# EAGLE design aparture_v1 (EAGLE 6.3)
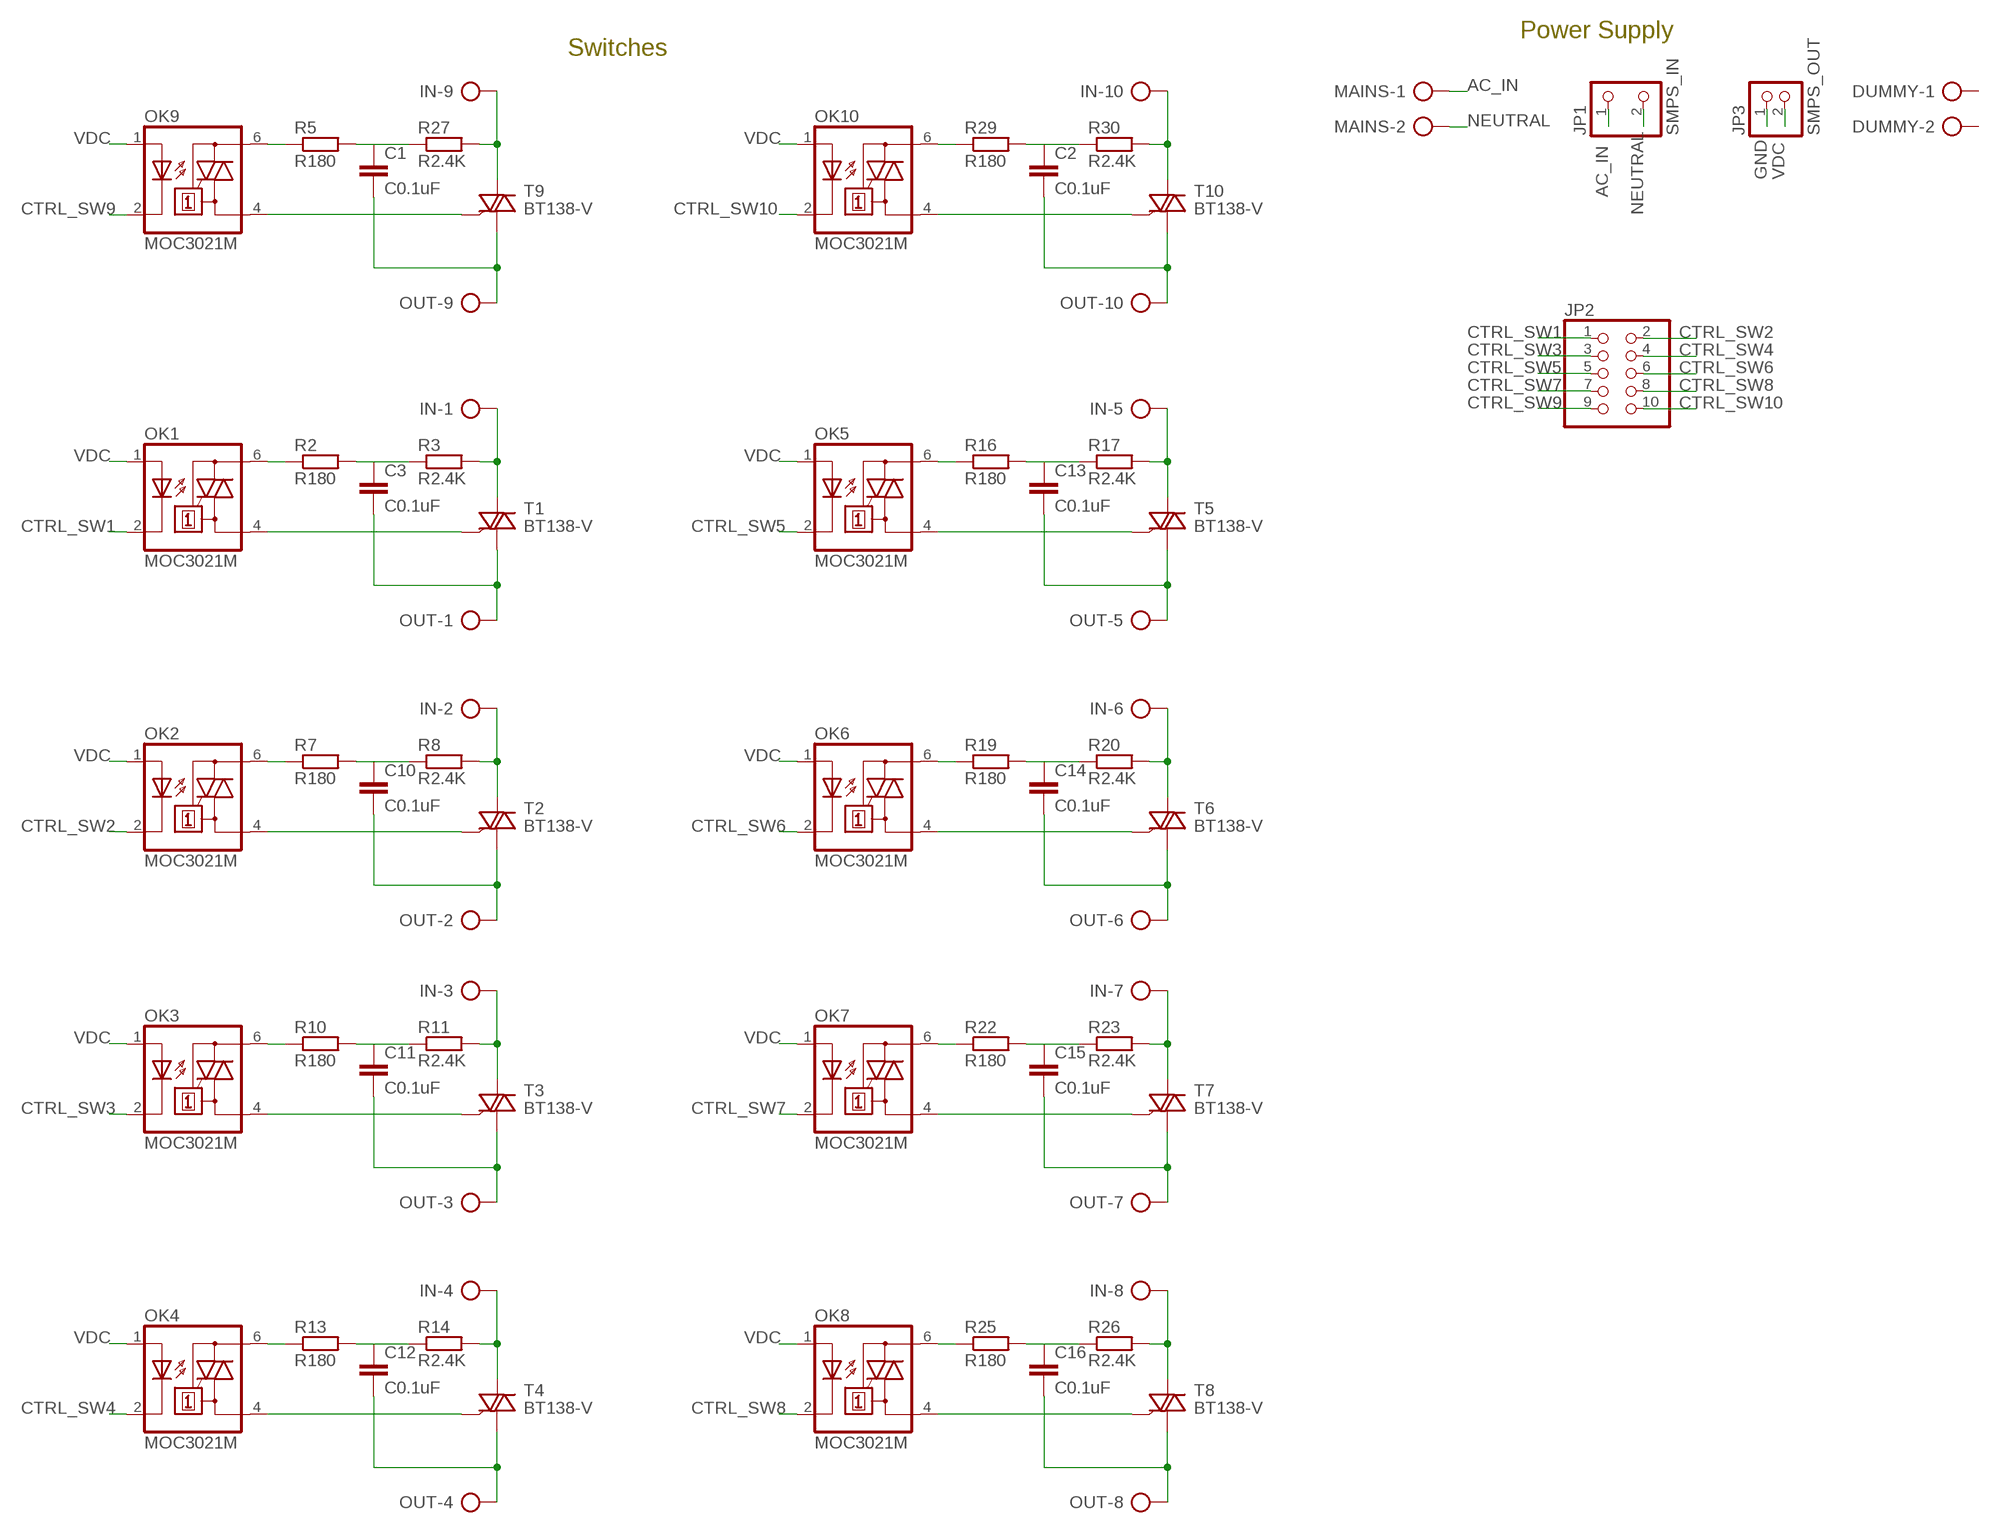
[diagram p0: schematic, sheet 1]

## Parts
C1  C0.1uF  C-EUC0805  [C0805]
C2  C0.1uF  C-EUC0805  [C0805]
C3  C0.1uF  C-EUC0805  [C0805]
C10  C0.1uF  C-EUC0805  [C0805]
C11  C0.1uF  C-EUC0805  [C0805]
C12  C0.1uF  C-EUC0805  [C0805]
C13  C0.1uF  C-EUC0805  [C0805]
C14  C0.1uF  C-EUC0805  [C0805]
C15  C0.1uF  C-EUC0805  [C0805]
C16  C0.1uF  C-EUC0805  [C0805]
DUMMY  AK300/2  [AK300/2]
IN  AK300/10  [AK300/10]
JP1  SMPS_IN  [SMPS_IN]
JP2  PINHD-2X5  [2X05]
JP3  SMPS_OUT  PINHD-1X2  [1X02]
MAINS  AK300/2  [AK300/2]
OK1  MOC3021M  [DIL06]
OK2  MOC3021M  [DIL06]
OK3  MOC3021M  [DIL06]
OK4  MOC3021M  [DIL06]
OK5  MOC3021M  [DIL06]
OK6  MOC3021M  [DIL06]
OK7  MOC3021M  [DIL06]
OK8  MOC3021M  [DIL06]
OK9  MOC3021M  [DIL06]
OK10  MOC3021M  [DIL06]
OUT  AK300/10  [AK300/10]
R2  R180  R-EU_M0805  [M0805]
R3  R2.4K  R-EU_M0805  [M0805]
R5  R180  R-EU_M0805  [M0805]
R7  R180  R-EU_M0805  [M0805]
R8  R2.4K  R-EU_M0805  [M0805]
R10  R180  R-EU_M0805  [M0805]
R11  R2.4K  R-EU_M0805  [M0805]
R13  R180  R-EU_M0805  [M0805]
R14  R2.4K  R-EU_M0805  [M0805]
R16  R180  R-EU_M0805  [M0805]
R17  R2.4K  R-EU_M0805  [M0805]
R19  R180  R-EU_M0805  [M0805]
R20  R2.4K  R-EU_M0805  [M0805]
R22  R180  R-EU_M0805  [M0805]
R23  R2.4K  R-EU_M0805  [M0805]
R25  R180  R-EU_M0805  [M0805]
R26  R2.4K  R-EU_M0805  [M0805]
R27  R2.4K  R-EU_M0805  [M0805]
R29  R180  R-EU_M0805  [M0805]
R30  R2.4K  R-EU_M0805  [M0805]
T1  BT138-V  [TO220BV]
T2  BT138-V  [TO220BV]
T3  BT138-V  [TO220BV]
T4  BT138-V  [TO220BV]
T5  BT138-V  [TO220BV]
T6  BT138-V  [TO220BV]
T7  BT138-V  [TO220BV]
T8  BT138-V  [TO220BV]
T9  BT138-V  [TO220BV]
T10  BT138-V  [TO220BV]

## Nets
AC_IN: JP1.1 MAINS.1
CTRL_SW1: JP2.1 OK1.2(C)
CTRL_SW2: JP2.2 OK2.2(C)
CTRL_SW3: JP2.3 OK3.2(C)
CTRL_SW4: JP2.4 OK4.2(C)
CTRL_SW5: JP2.5 OK5.2(C)
CTRL_SW6: JP2.6 OK6.2(C)
CTRL_SW7: JP2.7 OK7.2(C)
CTRL_SW8: JP2.8 OK8.2(C)
CTRL_SW9: JP2.9 OK9.2(C)
CTRL_SW10: JP2.10 OK10.2(C)
GND: JP3.1
N$3: OK1.6(A2) R2.1
N$4: C3.1 R2.2 R3.1
N$5: OK1.4(A1) T1.G
N$6: C3.2 OUT.1 T1.T1(A1)
N$9: IN.1 R3.2 T1.T2(A2)
N$12: OK2.6(A2) R7.1
N$13: C10.1 R7.2 R8.1
N$14: OK2.4(A1) T2.G
N$15: C10.2 OUT.2 T2.T1(A1)
N$18: OK3.6(A2) R10.1
N$19: C11.1 R10.2 R11.1
N$20: OK3.4(A1) T3.G
N$21: C11.2 OUT.3 T3.T1(A1)
N$24: OK4.6(A2) R13.1
N$25: C12.1 R13.2 R14.1
N$26: OK4.4(A1) T4.G
N$27: C12.2 OUT.4 T4.T1(A1)
N$30: OK5.6(A2) R16.1
N$31: C13.1 R16.2 R17.1
N$32: OK5.4(A1) T5.G
N$33: C13.2 OUT.5 T5.T1(A1)
N$36: OK6.6(A2) R19.1
N$37: C14.1 R19.2 R20.1
N$38: OK6.4(A1) T6.G
N$39: C14.2 OUT.6 T6.T1(A1)
N$42: OK7.6(A2) R22.1
N$43: C15.1 R22.2 R23.1
N$44: OK7.4(A1) T7.G
N$45: C15.2 OUT.7 T7.T1(A1)
N$48: OK8.6(A2) R25.1
N$49: C16.1 R25.2 R26.1
N$50: OK8.4(A1) T8.G
N$51: C16.2 OUT.8 T8.T1(A1)
N$52: IN.2 R8.2 T2.T2(A2)
N$53: IN.3 R11.2 T3.T2(A2)
N$54: IN.4 R14.2 T4.T2(A2)
N$55: IN.8 R26.2 T8.T2(A2)
N$56: IN.7 R23.2 T7.T2(A2)
N$57: IN.6 R20.2 T6.T2(A2)
N$58: IN.5 R17.2 T5.T2(A2)
N$59: OK9.6(A2) R5.1
N$60: C1.1 R5.2 R27.1
N$61: OK9.4(A1) T9.G
N$62: C1.2 OUT.9 T9.T1(A1)
N$65: OK10.6(A2) R29.1
N$66: C2.1 R29.2 R30.1
N$67: OK10.4(A1) T10.G
N$68: C2.2 OUT.10 T10.T1(A1)
N$69: IN.9 R27.2 T9.T2(A2)
N$70: IN.10 R30.2 T10.T2(A2)
NEUTRAL: JP1.2 MAINS.2
VDC: JP3.2 OK1.1(A) OK2.1(A) OK3.1(A) OK4.1(A) OK5.1(A) OK6.1(A) OK7.1(A) OK8.1(A) OK9.1(A) OK10.1(A)
Unconnected: DUMMY.1 DUMMY.2

## Notes on the sheet
- Power Supply
- Switches

## Library data of the parts
C1-C3 C10-C16 = resistor:C-EU: CAPACITOR, European symbol
DUMMY MAINS = con-ptr500:AK300/2: CONNECTOR; OC_FARNELL: unknown; OC_NEWARK: unknown
IN OUT = con-ptr500:AK300/10: CONNECTOR; OC_FARNELL: unknown; OC_NEWARK: unknown
JP1 = tigorcustom:SMPS_IN: PIN HEADER
JP2 = pinhead:PINHD-2X5: PIN HEADER
JP3 = pinhead:PINHD-1X2: PIN HEADER
OK1-OK10 = optocoupler:MOC30*M: RANDOM-PHASE OPTOISOLATORS TRIAC DRIVER OUTPUT Source: http://www.fairchildsemi.com MOC3020-M.pdf; MF: FAIRCHILD SEMICONDUCTOR; MPN: MOC3021-M; OC_FARNELL: 1021365; OC_NEWARK: 95B7895
R2 R3 R5 R7 R8 R10 R11 R13 R14 R16 R17 R19 R20 R22 R23 R25-R27 R29 R30 = resistor:R-EU_: RESISTOR, European symbol
T1-T10 = triac:BT138: TRIAC Source: http://www.semiconductors.philips.com BT138_SERIES_2.pdf

## Board
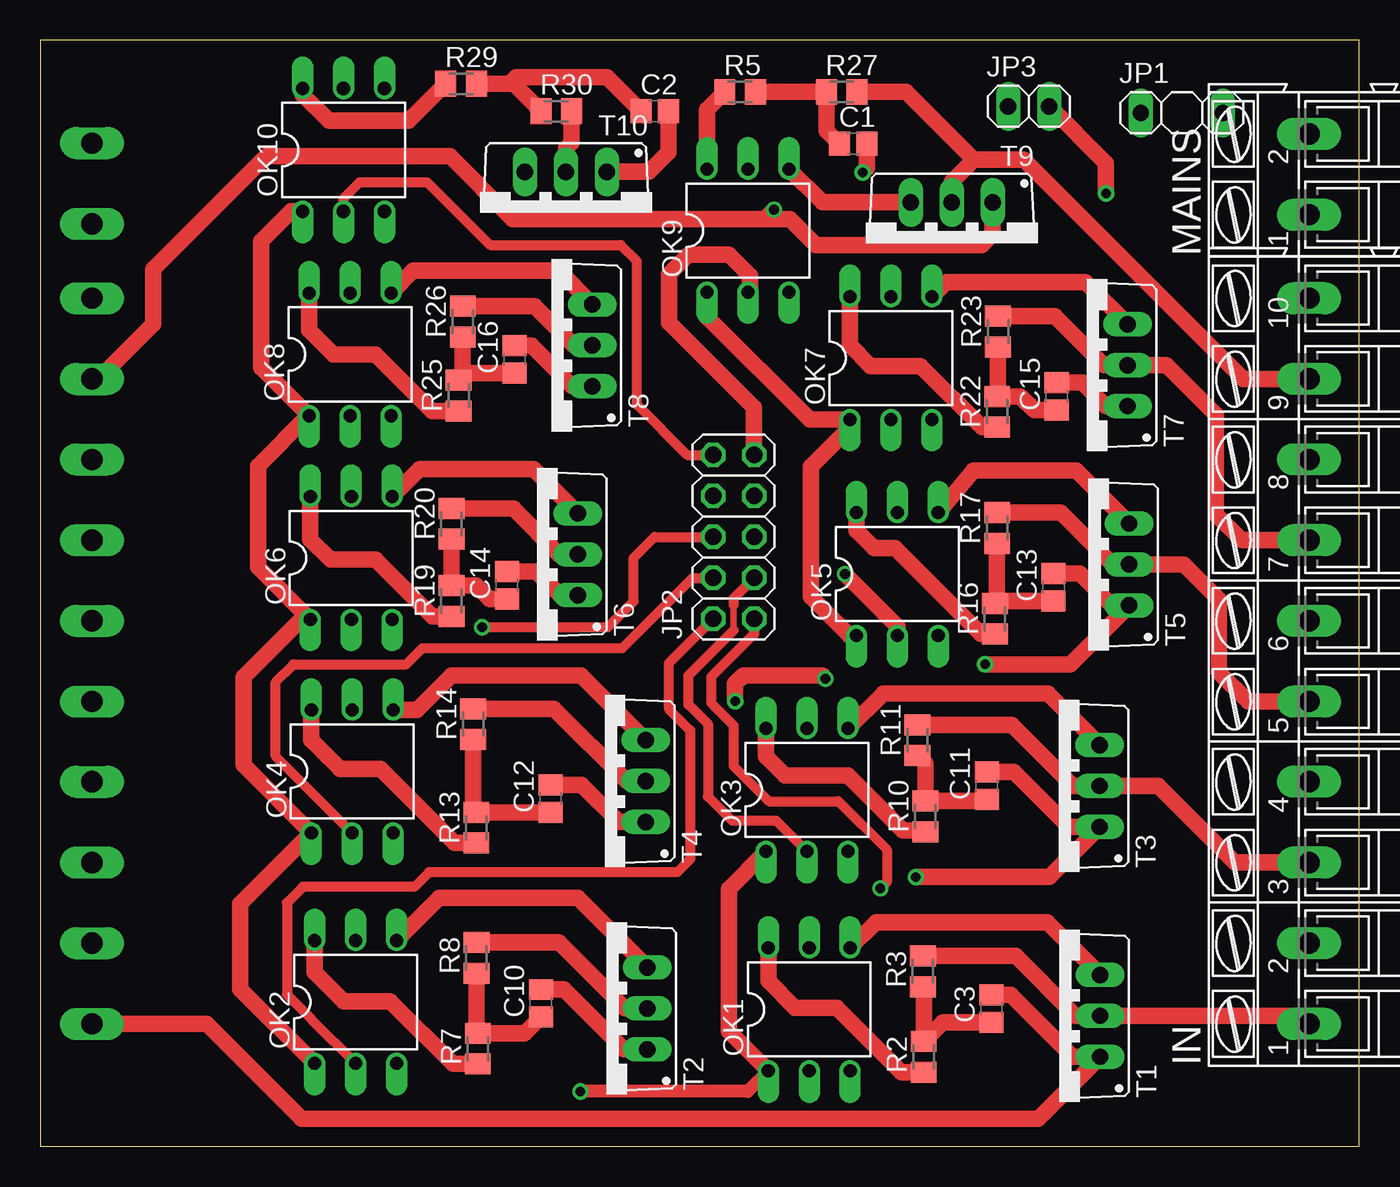
[diagram p1: board, top side]
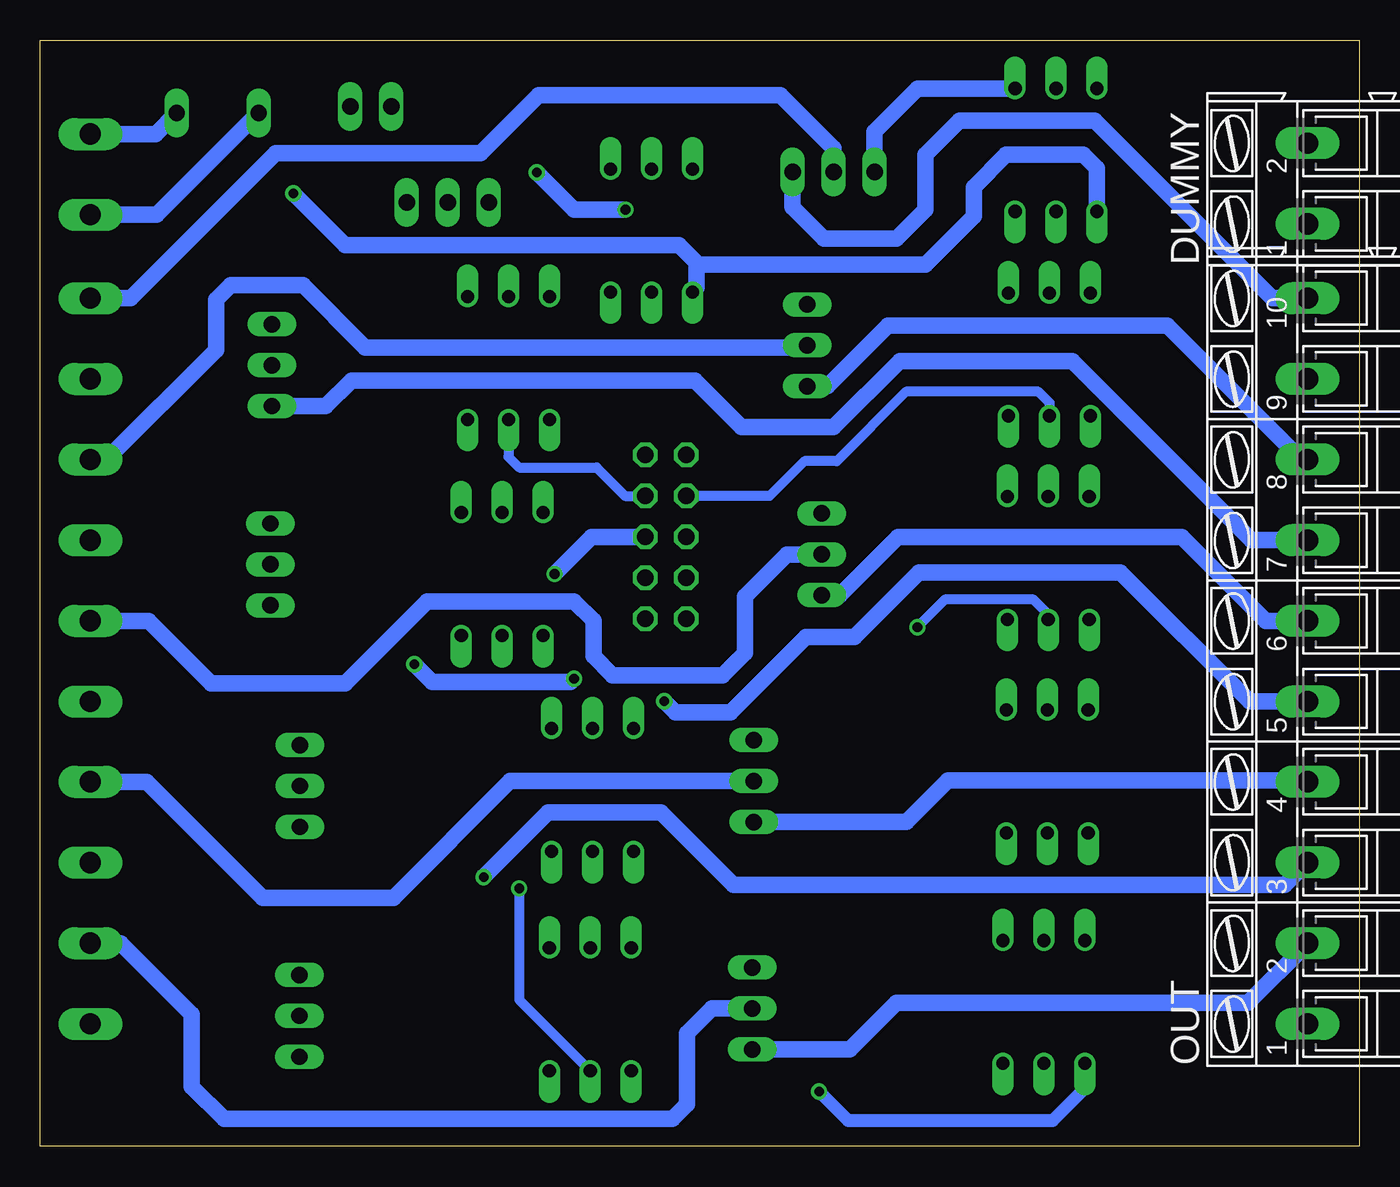
[diagram p2: board, bottom side, seen from below]

Size 81.8 x 68.6 mm. Coordinates in mm from the lower left corner, seen from the top.
Outline: 0,0 81.8,0 81.8,68.6 0,68.6 0,0
Copper layers (1*16): Top 0.035mm / dielectric 1.5mm / Bottom 0.035mm
Design rules "default": minimum track width 10mil, minimum drill 24mil, track to track 8mil, track to pad 8mil, pad to pad 8mil, via to via 8mil, smd to smd 8mil, copper to edge 40mil, drill to drill 8mil, minimum pad ring 10mil, minimum via ring 8mil, stop-mask expansion 4mil, vias tented up to drill 0mil, thermal gap 10mil

### Footprints (pad centres in the part's own frame; a part is rotated, then mirrored left to right if it is on the bottom)
C0805 = smd 1.3 x 1.5: 1 -0.85,0; 2 0.85,0
AK300/2 = drill 1.321 long: 1 -2.515,0; 2 2.489,0
AK300/10 = drill 1.321 long: 1 -22.504,0; 2 -17.501,0; 3 -12.497,0; 4 -7.493,0; 5 -2.515,0; 6 2.489,0; 7 7.493,0; 8 12.497,0; 9 17.501,0; 10 22.504,0
SMPS_IN = drill 1.016 long: 1 -2.54,0; 2 2.54,0
2X05 = drill 1.016 octagon: 1 -5.08,-1.27; 2 -5.08,1.27; 3 -2.54,-1.27; 4 -2.54,1.27; 5 0,-1.27; 6 0,1.27; 7 2.54,-1.27; 8 2.54,1.27; 9 5.08,-1.27; 10 5.08,1.27
1X02 = drill 1.016 long: 1 -1.27,0; 2 1.27,0
DIL06 = drill 0.813 offset: 1 -2.54,-3.81; 2 0,-3.81; 3 2.54,-3.81; 4 2.54,3.81; 5 0,3.81; 6 -2.54,3.81
M0805 = smd 1.3 x 1.6: 1 -0.95,0; 2 0.95,0
TO220BV = drill 1.016 long: G 2.54,-2.54; T1 -2.54,-2.54; T2 0,-2.54

### Placement (x,y rotation side)
C1  50.41,62.19 0 top
C2  38.1,64.2 0 top
C3  58.99,8.55 90 top
C10  31.05,8.87 90 top
C11  58.7,22.37 90 top
C12  31.65,21.57 90 top
C13  62.84,34.67 90 top
C14  28.94,34.79 90 top
C15  63.04,46.51 90 top
C16  29.42,48.8 90 top
DUMMY  3.2,59.73 90 bottom
IN  78.7,30.1 90 top
JP1  70.8,64.1 0 top
JP2  43,37.8 90 top
JP3  61.3,64.5 0 top
MAINS  78.7,60.3 90 top
OK1  47.69,8.49 0 top
OK2  19.55,8.95 0 top
OK3  47.55,22.1 0 top
OK4  19.35,23.25 0 top
OK5  53.15,35.49 0 top
OK6  19.29,36.49 0 top
OK7  52.76,48.89 0 top
OK8  19.22,49.12 0 top
OK9  43.9,56.8 0 top
OK10  18.8,61.8 0 top
OUT  3.2,30.1 90 bottom
R2  54.79,5.55 90 top
R3  54.74,10.85 90 top
R5  43.4,65.4 0 top
R7  27.14,6.06 90 top
R8  27.05,11.69 90 top
R10  54.89,20.46 90 top
R11  54.4,25.19 90 top
R13  27.04,19.76 90 top
R14  26.85,26.19 90 top
R16  59.2,32.72 90 top
R17  59.34,38.35 90 top
R19  25.5,33.82 90 top
R20  25.5,38.61 90 top
R22  59.35,45.56 90 top
R23  59.4,50.53 90 top
R25  25.95,46.56 90 top
R26  26.2,51.15 90 top
R27  49.7,65.4 0 top
R29  26.1,65.9 0 top
R30  32,64.2 0 top
T1  63.2,8.09 90 top
T2  35.11,8.55 90 top
T3  63.16,22.35 90 top
T4  35.01,22.65 90 top
T5  65,36.09 90 top
T6  30.8,36.72 90 top
T7  64.9,48.45 90 top
T8  31.7,49.68 90 top
T9  56.53,56.01 180 top
T10  32.6,57.9 180 top

### Tracks (layer width: path | path; a pad name or v marks a point on that pad's centre or on a via)
AC_IN
  Bottom 1.016: 77.7,57.78 MAINS.1 74.58,57.78 JP1.1
CTRL_SW1  (via drill 0.6)
  Top 0.61: JP2.1 44.27,31.77 41.6,29.1 41.6,27.5 43,26.1 43,23.6 45.2,21.4 49.5,21.4 52.5,18.4 52.5,16.4 v52.1,16
  Bottom 0.61: v52.1,16 52.1,9.09 OK1.2
CTRL_SW2
  Top 0.61: JP2.2 39,29.99 39,27.1 40.3,25.8 40.3,17.8 39.5,17 24.1,17 23.2,16.1 16.3,16.1 15.3,15.1 15.3,9.4 16.8,7.9 16.8,7.89 OK2.2
CTRL_SW3
  Top 0.406: 43,33.6 43,32
  Top 0.61: JP2.3 43,33.99 43,33.6 | 43,32 40.2,29.2 40.2,27.4 41.4,26.2 41.4,21.7 42.9,20.2 45.64,20.2 OK3.2
CTRL_SW4
  Top 0.61: OK4.2 14.6,24.19 14.6,28.8 15.7,29.9 22.7,29.9 23.7,30.9 36.1,30.9 40.46,35.26 JP2.4
CTRL_SW5  (via drill 0.6)
  Top 1.016: v49.9,35.5 53.15,32.25 OK5.2
  Bottom 1.016: v49.9,35.5 47.6,37.8 JP2.5
CTRL_SW6  (via drill 0.6)
  Top 0.61: JP2.6 38.1,37.8 36.8,36.5 36.8,33.8 35.2,32.2 v27.4,32.2
  Bottom 0.61: v27.4,32.2 25.7,33.9 20.2,33.9 19.29,32.99 OK6.2
CTRL_SW7
  Bottom 0.61: OK7.2 52.76,42.76 52.1,42.1 47.3,42.1 45.54,40.34 JP2.7
CTRL_SW8
  Bottom 0.61: OK8.2 19.2,45.33 19.2,46.1 19.9,46.8 28.1,46.8 32.4,42.5 34.4,42.5 36.56,40.34 JP2.8
CTRL_SW9
  Top 1.016: OK9.2 44,53.09 44,54 42.7,55.3 40.2,55.3 39,54.1 39,51.1 44.27,45.83 JP2.9
CTRL_SW10
  Top 0.61: JP2.10 40.12,42.88 37,46 37,54.9 36,55.9 27.9,55.9 24,59.8 19.8,59.8 18.8,58.8 OK10.2
N$3
  Top 1.016: R2.1 53.4,4.6 49.4,8.6 46.8,8.6 45.15,10.25 OK1.6
N$4
  Top 1.016: C3.1 55.99,7.7 R2.2 54.79,9.85 R3.1
N$5
  Top 1.016: T1.G 62.47,13.9 51.83,13.9 OK1.4
N$6
  Top 1.016: C3.2 60.2,9.4 64.05,5.55 T1.T1 61.89,1.7 16.2,1.7 10.3,7.6 OUT.1
N$9
  Top 1.016: R3.2 60.5,11.8 64.21,8.09 T1.T2 78.21,8.09 IN.1
N$12
  Top 1.016: R7.1 25.59,5.11 21.7,9 18.8,9 17.01,10.79 OK2.6
N$13
  Top 1.016: R8.1 27.05,7.1 R7.2 30.04,7.01 C10.1
N$14
  Top 1.016: T2.G 33.34,15.4 24.73,15.4 OK2.4
N$15
  Top 1.016: T2.T1 36.19,6.01 32.48,9.72 C10.2
  Bottom 1.016: T2.T1 31.59,6.01 28.7,8.9 6.9,8.9 OUT.2
N$18
  Top 1.016: OK3.6 45.01,24.19 46.2,23 50.1,23 53.5,19.6 54.8,19.6 R10.1
N$19
  Top 1.016: C11.1 58.59,21.41 R10.2 54.89,23.75 R11.1
N$20
  Top 1.016: T3.G 62.49,28.1 52.28,28.1 OK3.4
N$21  (via drill 0.6)
  Top 1.016: C11.2 60.38,23.22 63.79,19.81 T3.T1 62.59,16.7 v54.3,16.7
  Bottom 1.016: v54.3,16.7 50.3,20.7 43.3,20.7 38.8,16.2 4.6,16.2 OUT.3
N$24
  Top 1.016: R13.1 25.69,18.81 21.1,23.4 18.6,23.4 16.81,25.19 OK4.6
N$25
  Top 1.016: R14.1 26.85,20.9 R13.2 30.34,20.71 C12.1
N$26
  Top 1.016: T4.G 33.54,29.2 25.5,29.2 23.36,27.06 OK4.4
N$27
  Top 1.016: 36.49,20.11 T4.T1 35.89,20.11 33.58,22.42 C12.2
  Bottom 1.016: T4.T1 28.09,20.11 25.5,22.7 3.2,22.7 OUT.4
N$30
  Top 1.016: OK5.6 50.61,38.19 51.7,37.1 53.01,37.1 58.34,31.77 R16.1
N$31
  Top 1.016: C13.1 59.35,33.82 | 59.35,33.82 R16.2 | 59.35,33.82 59.34,33.83 R17.1
N$32
  Top 1.016: T5.G 64.27,41.9 57.86,41.9 OK5.4
N$33  (via drill 0.6)
  Top 1.016: C13.2 64.48,35.52 66.45,33.55 T5.T1 63.89,29.9 v58.6,29.9 | v43.1,27.6 43.1,28.7 43.6,29.2 48.5,29.2 v48.7,29
  Bottom 1.016: v48.7,29 48.9,28.8 57.5,28.8 v58.6,29.9 | v43.1,27.6 42.4,26.9 39,26.9 34.3,31.6 31.3,31.6 27.3,35.6 14.8,35.6 6.79,27.59 OUT.5
N$36
  Top 1.016: R19.1 24.33,32.87 20.8,36.4 18,36.4 16.75,37.65 OK6.6
N$37
  Top 1.016: 25.3,37.46 R20.1 R19.2 27.03,34.77 27.86,33.94 C14.1
N$38
  Top 1.016: T6.G 30.6,42 23.53,42 OK6.4
N$39
  Top 1.016: T6.T1 32.22,34.18 30.76,35.64 C14.2
  Bottom 1.016: T6.T1 32.22,34.18 28.6,37.8 11,37.8 5.79,32.59 OUT.6
N$42
  Top 1.016: R22.1 58.39,44.61 54.6,48.4 51.5,48.4 50.2,49.7 50.22,49.72 OK7.6
N$43
  Top 1.016: 59.15,49.33 R23.1 59.4,46.56 R22.2 60.79,46.51 61.64,45.66 C15.1
N$44
  Top 1.016: T7.G 64.83,53.6 56.2,53.6 OK7.4
N$45
  Top 1.016: T7.T1 66.09,45.91 64.64,47.36 C15.2
  Bottom 1.016: T7.T1 64.09,45.91 62.5,47.5 41.2,47.5 38.3,44.6 32.6,44.6 28.5,48.7 17.8,48.7 6.69,37.59 OUT.7
N$48
  Top 1.016: R25.1 24.29,45.61 20.8,49.1 18.2,49.1 16.68,50.62 OK8.6
N$49
  Top 1.016: R26.1 26.2,47.76 R25.2 26.39,47.95 C16.1
N$50
  Top 1.016: OK8.4 23.13,54.3 32.16,54.3 T8.G
N$51
  Top 1.016: C16.2 30.47,49.65 32.98,47.14 T8.T1
  Bottom 1.016: OUT.8 3.6,42.6 11.9,50.9 29.22,50.9 32.98,47.14 T8.T1
N$52
  Top 1.016: T2.T2 36.25,8.55 32.16,12.64 R8.2
  Bottom 1.016: IN.2 76.8,12.6 72.4,8.2 72.4,3.7 70.4,1.7 42.6,1.7 41.7,2.6 41.7,7 40.15,8.55 T2.T2
N$53
  Top 1.016: IN.3 74.1,17.6 69.35,22.35 T3.T2 64.05,22.35 60.26,26.14 R11.2
N$54
  Top 1.016: T4.T2 36.35,22.65 31.86,27.14 R14.2
  Bottom 1.016: IN.4 75.21,22.61 68,15.4 59.9,15.4 52.65,22.65 T4.T2
N$55
  Top 1.016: T8.T2 33.07,49.68 30.65,52.1 R26.2
  Bottom 1.016: IN.8 77.7,42.6 70.9,49.4 70.9,52.5 70,53.4 65.5,53.4 61.65,49.55 34.37,49.55 T8.T2
N$56
  Top 1.016: IN.7 74.51,37.59 72.9,39.2 72.9,45.4 69.85,48.45 T7.T2 65.95,48.45 62.92,51.48 R23.2
N$57
  Top 1.016: T6.T2 32.18,36.72 29.34,39.56 R20.2
  Bottom 1.016: IN.6 75.09,32.59 71.2,28.7 62.9,28.7 57.8,33.8 48.7,33.8 47.5,32.6 47.5,30.4 46.3,29.2 39.5,29.2 38.1,30.6 38.1,34.1 35.48,36.72 T6.T2
N$58
  Top 1.016: IN.5 74.92,27.59 73.1,29.4 73.1,33.9 70.91,36.09 T5.T2 66.51,36.09 63.3,39.3 R17.2
N$59
  Top 1.016: R5.1 41.36,64.31 OK9.6
N$60
  Top 1.016: R5.2 R27.1 48.75,63 C1.1
N$61
  Top 1.016: T9.G 48.5,58.55 OK9.4
N$62  (via drill 0.6)
  Top 1.016: 59.04,57.44 59.05,57.89 | 59.05,57.89 T9.T1 | OUT.9 3.6,47.6 7,51 7,54.4 14,61.4 25.4,61.4 29.3,57.5 44.4,57.5 44.9,57.5 | 44.9,57.5 46.5,57.5 48.1,55.9 58.4,55.9 59.05,56.55 59.05,57.89 | C1.2 51.26,60.66 v51,60.4 | v45.5,58.1 44.9,57.5
  Bottom 1.016: v51,60.4 48.7,58.1 v45.5,58.1
N$65
  Top 1.016: OK10.6 16.26,65.24 17.9,63.6 22.85,63.6 R29.1
N$66
  Top 1.016: R30.1 29.35,65.9 29.1,65.9 | 29.1,65.9 R29.2 | C2.1 35.15,66.3 29.5,66.3 29.1,65.9
N$67
  Bottom 1.016: T10.G 30.06,62.94 27.39,65.61 OK10.4
N$68
  Top 1.016: 35.45,60.75 T10.T1 37.74,60.44 38.95,61.65 C2.2
  Bottom 1.016: T10.T1 35.14,58.24 33.2,56.3 28.7,56.3 26.9,58.1 26.9,61.5 24.8,63.6 16.4,63.6 5.4,52.6 OUT.10
N$69
  Top 1.016: IN.9 74.6,47.6 61,61.2 57.9,61.2 | 57.9,61.2 56.53,59.83 T9.T2 | R27.2 53.7,65.4 57.9,61.2
N$70
  Top 1.016: T10.T2 32.6,61.9 32.95,62.25 R30.2
  Bottom 1.016: T10.T2 32.6,61.9 35.9,65.2 50.9,65.2 54.5,61.6 67.2,61.6 76.2,52.6 IN.10 77.7,52.6
NEUTRAL
  Bottom 1.016: 77.7,62.79 MAINS.2 74.65,62.79 JP1.2
VDC  (via drill 0.6)
  Top 0.813: OK1.1 43.87,3.4 v33.5,3.4
  Top 1.016: OK2.1 12.4,9.75 12.4,15.03 OK4.1 12.6,23.65 12.6,29.1 16.18,32.68 OK6.1 13.5,35.93 13.5,42.2 16.61,45.31 OK8.1 13.7,48.29 13.7,56.13 15.56,57.99 OK10.1 | OK3.1 42.7,15.98 42.7,7.13 OK1.1 | OK5.1 50.18,31.68 47.8,34.06 47.8,42.16 50.22,44.58 OK7.1 47.72,45.08 41.36,51.44 OK9.1 | v66.1,59.1 66.1,60.97 JP3.2
  Bottom 0.813: v33.5,3.4 31.7,1.6 19,1.6 17.01,3.59 OK2.1
  Bottom 1.016: OK10.1 16.26,60.66 17.1,61.5 21.9,61.5 23.9,59.5 23.9,57.7 26.9,54.7 41,54.7 | 41,54.7 41.07,54.7 | 41.1,54.8 42.2,55.9 62.9,55.9 v66.1,59.1 | 41.1,54.8 41,54.7 | OK9.1 41.1,53.25 41.1,54.8